# EAGLE design Adafruit GPIO Expander Bonnet (EAGLE 9.2.0)
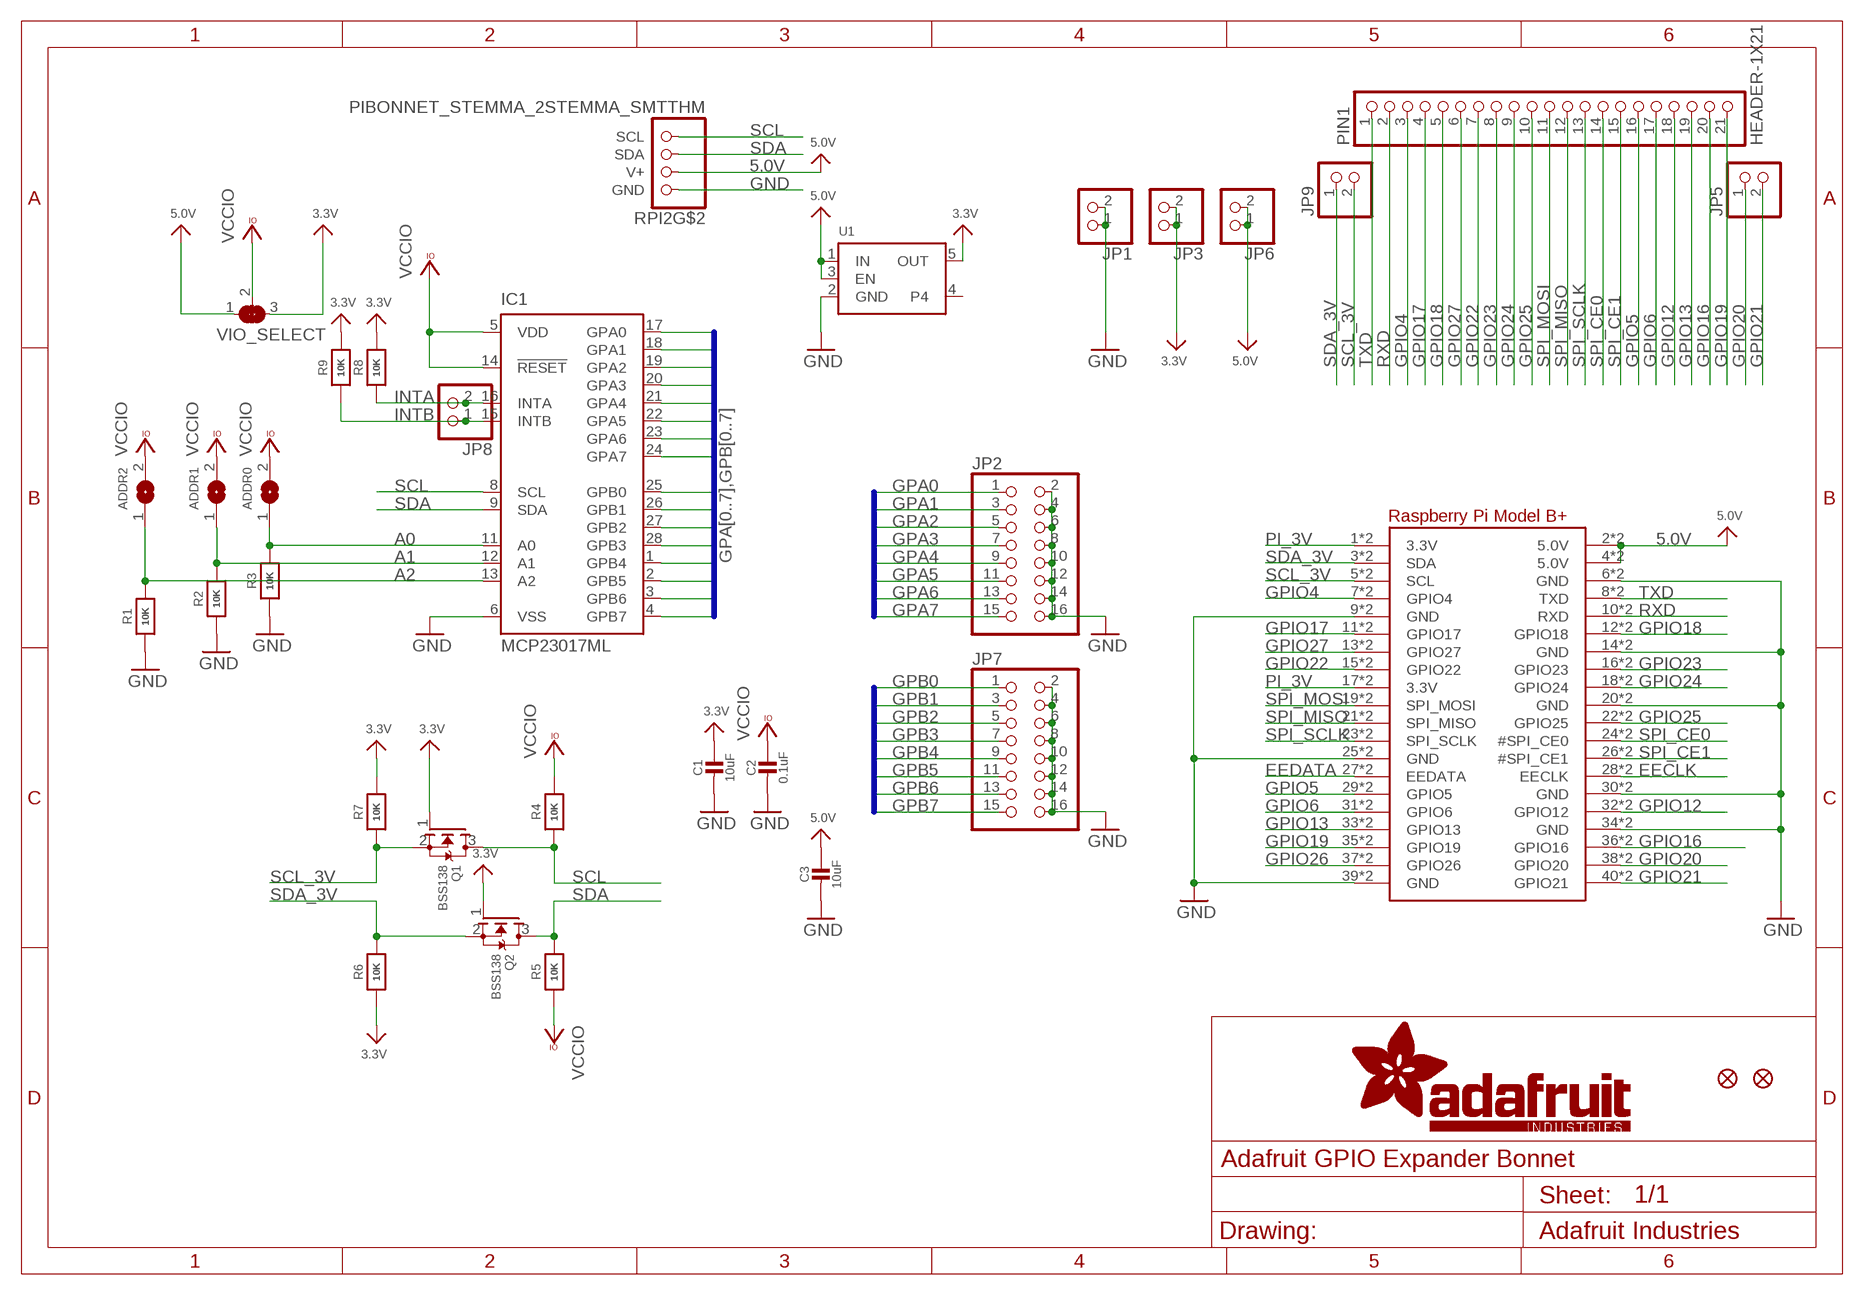
[diagram p0: schematic, sheet 1]

## Parts
ADDR0  SOLDERJUMPER  [SOLDERJUMPER_ARROW_NOPASTE]
ADDR1  SOLDERJUMPER  [SOLDERJUMPER_ARROW_NOPASTE]
ADDR2  SOLDERJUMPER  [SOLDERJUMPER_ARROW_NOPASTE]
C1  10uF  CAP_CERAMIC0805-NOOUTLINE  [0805-NO]
C2  0.1uF  CAP_CERAMIC0603_NO  [0603-NO]
C3  10uF  CAP_CERAMIC0805-NOOUTLINE  [0805-NO]
FID1  FIDUCIAL_1MM  [FIDUCIAL_1MM]
FID2  FIDUCIAL_1MM  [FIDUCIAL_1MM]
IC1  MCP23017ML  [QFN28-ML_6X6MM]
JP1  HEADER-1X2ROUND  [1X02_ROUND]
JP2  HEADER-2X8_SHROUDED  [2X08_SHROUDED]
JP3  HEADER-1X2ROUND  [1X02_ROUND]
JP5  HEADER-1X2ROUND  [1X02_ROUND]
JP6  HEADER-1X2ROUND  [1X02_ROUND]
JP7  HEADER-2X8_SHROUDED  [2X08_SHROUDED]
JP8  HEADER-1X2ROUND  [1X02_ROUND]
JP9  HEADER-1X2ROUND  [1X02_ROUND]
PIN1  HEADER-1X21  [1X21_ROUND_70MIL]
Q1  BSS138  MOSFET-NWIDE  [SOT23-WIDE]
Q2  BSS138  MOSFET-NWIDE  [SOT23-WIDE]
R1  10K  RESISTOR_0603_NOOUT  [0603-NO]
R2  10K  RESISTOR_0603_NOOUT  [0603-NO]
R3  10K  RESISTOR_0603_NOOUT  [0603-NO]
R4  10K  RESISTOR_0603_NOOUT  [0603-NO]
R5  10K  RESISTOR_0603_NOOUT  [0603-NO]
R6  10K  RESISTOR_0603_NOOUT  [0603-NO]
R7  10K  RESISTOR_0603_NOOUT  [0603-NO]
R8  10K  RESISTOR_0603_NOOUT  [0603-NO]
R9  10K  RESISTOR_0603_NOOUT  [0603-NO]
RPI2  PIBONNET_STEMMA_2STEMMA_SMTTHM  [PI_BONNET_2STEMMA_SMT]
U1  VREG_SOT23-5  [SOT23-5]
VIO_SELECT  SOLDERJUMPER_2WAY  [SOLDERJUMPER_2WAY_OPEN_NOPASTE]

## Nets
3.3V: C1.1 JP3.1 JP3.2 Q1.1(G) Q2.1(G) R6.1 R7.2 R8.2 R9.2 U1.5(OUT) VIO_SELECT.3
5.0V: C3.1 JP6.1 JP6.2 RPI2.2(5.0V) RPI2.4(5.0V) RPI2.S2(5.0V) RPI2.S4(5.0V) RPI2.V+ RPI2.V+1(V+) U1.1(IN) U1.3(EN) VIO_SELECT.1
A0: ADDR0.1 IC1.11(A0) R3.2
A1: ADDR1.1 IC1.12(A1) R2.2
A2: ADDR2.1 IC1.13(A2) R1.2
EECLK: RPI2.28(EECLK) RPI2.S28(EECLK)
EEDATA: RPI2.27(EEDATA) RPI2.S27(EEDATA)
GND: C1.2 C2.2 C3.2 IC1.6(VSS) JP1.1 JP1.2 JP2.2 JP2.4 JP2.6 JP2.8 JP2.10 JP2.12 JP2.14 JP2.16 JP7.2 JP7.4 JP7.6 JP7.8 JP7.10 JP7.12 JP7.14 JP7.16 R1.1 R2.1 R3.1 RPI2.6(GND) RPI2.9(GND) RPI2.14(GND) RPI2.20(GND) RPI2.25(GND) RPI2.30(GND) RPI2.34(GND) RPI2.39(GND) RPI2.GND RPI2.GND1(GND) RPI2.S6(GND) RPI2.S9(GND) RPI2.S14(GND) RPI2.S20(GND) RPI2.S25(GND) RPI2.S30(GND) RPI2.S34(GND) RPI2.S39(GND) U1.2(GND)
GPA0: IC1.17(GPA0) JP2.1
GPA1: IC1.18(GPA1) JP2.3
GPA2: IC1.19(GPA2) JP2.5
GPA3: IC1.20(GPA3) JP2.7
GPA4: IC1.21(GPA4) JP2.9
GPA5: IC1.22(GPA5) JP2.11
GPA6: IC1.23(GPA6) JP2.13
GPA7: IC1.24(GPA7) JP2.15
GPB0: IC1.25(GPB0) JP7.1
GPB1: IC1.26(GPB1) JP7.3
GPB2: IC1.27(GPB2) JP7.5
GPB3: IC1.28(GPB3) JP7.7
GPB4: IC1.1(GPB4) JP7.9
GPB5: IC1.2(GPB5) JP7.11
GPB6: IC1.3(GPB6) JP7.13
GPB7: IC1.4(GPB7) JP7.15
GPIO4: PIN1.3 RPI2.7(GPIO4) RPI2.S7(GPIO4)
GPIO5: PIN1.16 RPI2.29(GPIO5) RPI2.S29(GPIO5)
GPIO6: PIN1.17 RPI2.31(GPIO6) RPI2.S31(GPIO6)
GPIO12: PIN1.18 RPI2.32(GPIO12) RPI2.S32(GPIO12)
GPIO13: PIN1.19 RPI2.33(GPIO13) RPI2.S33(GPIO13)
GPIO16: PIN1.20 RPI2.36(GPIO16) RPI2.S36(GPIO16)
GPIO17: PIN1.4 RPI2.11(GPIO17) RPI2.S11(GPIO17)
GPIO18: PIN1.5 RPI2.12(GPIO18) RPI2.S12(GPIO18)
GPIO19: PIN1.21 RPI2.35(GPIO19) RPI2.S35(GPIO19)
GPIO20: JP5.1 RPI2.38(GPIO20) RPI2.S38(GPIO20)
GPIO21: JP5.2 RPI2.40(GPIO21) RPI2.S40(GPIO21)
GPIO22: PIN1.7 RPI2.15(GPIO22) RPI2.S15(GPIO22)
GPIO23: PIN1.8 RPI2.16(GPIO23) RPI2.S16(GPIO23)
GPIO24: PIN1.9 RPI2.18(GPIO24) RPI2.S18(GPIO24)
GPIO25: PIN1.10 RPI2.22(GPIO25) RPI2.S22(GPIO25)
GPIO26: RPI2.37(GPIO26) RPI2.S37(GPIO26)
GPIO27: PIN1.6 RPI2.13(GPIO27) RPI2.S13(GPIO27)
INTA: IC1.16(INTA) JP8.2 R8.1
INTB: IC1.15(INTB) JP8.1 R9.1
PI_3V: RPI2.1(3.3V) RPI2.17(3.3V) RPI2.S1(3.3V) RPI2.S17(3.3V)
RXD: PIN1.2 RPI2.10(RXD) RPI2.S10(RXD)
SCL: IC1.8(SCL) Q1.3(D) R4.1 RPI2.SCL RPI2.SCL1(SCL)
SCL_3V: JP9.2 Q1.2(S) R7.1 RPI2.5(SCL) RPI2.S5(SCL)
SDA: IC1.9(SDA) Q2.3(D) R5.2 RPI2.SDA RPI2.SDA1(SDA)
SDA_3V: JP9.1 Q2.2(S) R6.2 RPI2.3(SDA) RPI2.S3(SDA)
SPI_CE0: PIN1.14 RPI2.24(#SPI_CE0) RPI2.S24(#SPI_CE0)
SPI_CE1: PIN1.15 RPI2.26(#SPI_CE1) RPI2.S26(#SPI_CE1)
SPI_MISO: PIN1.12 RPI2.21(SPI_MISO) RPI2.S21(SPI_MISO)
SPI_MOSI: PIN1.11 RPI2.19(SPI_MOSI) RPI2.S19(SPI_MOSI)
SPI_SCLK: PIN1.13 RPI2.23(SPI_SCLK) RPI2.S23(SPI_SCLK)
TXD: PIN1.1 RPI2.8(TXD) RPI2.S8(TXD)
VCCIO: ADDR0.2 ADDR1.2 ADDR2.2 C2.1 IC1.5(VDD) IC1.14(!RESET) R4.2 R5.1 VIO_SELECT.2
Unconnected: U1.4

## Buses
GPA[0..7],GPB[0..7]

## Library data of the parts
ADDR0 ADDR1 ADDR2 = microbuilder:SOLDERJUMPER: SMD Solder JUMPER Solder the two pads together to create a connection, or remove the solder to break it. REFLOW - Use this footprint for solder paste and reflow ovens. WAVE - Use this footprint for hand-soldering (larger pads). CLOSED - Has a trace between the two pads to ensure it is closed by default. The trace needs to be cut to disable the jumper, and can be closed again by creating a solder bridge between the two pads.; BOM: EXCLUDE
C1-C3 = microbuilder:CAP_CERAMIC: Ceramic Capacitors For new designs, use the packages preceded by an '_' character since they are more reliable: The following footprints should be used on most boards: _0402 - Standard footprint for regular board layouts _0603 - Standard footprint for regular board layouts _0805 - Standard footprint for regular board layouts _1206 - Standard footprint for regular board layouts For extremely tight-pitch boards where space is at a premium, the following 'micro-pitch' footprints can be used (smaller pads, no silkscreen outline, etc.): _0402MP - Micro-pitch footprint for very dense/compact boards _0603MP - Micro-pitch footprint for very dense/compact boards _0805MP - Micro-pitch footprint for very dense/compact boards _1206MP - Micro-pitch footprint for very dense/compact boards
FID1 FID2 = microbuilder:FIDUCIAL: Fiducial Alignment Points Various fiducial points for machine vision alignment.; BOM: EXCLUDE
IC1 = microbuilder:MCP23017: http://ww1.microchip.com/downloads/en/DeviceDoc/21952a.pdf Source: http://ww1.microchip.com/downloads/en/DeviceDoc/21952a.pdf; MF: MICROCHIP; MPN: MCP23017-E/ML; OC_FARNELL: unknown; OC_NEWARK: 31K2957
JP1 JP3 JP5 JP6 JP8 JP9 = microbuilder:HEADER-1X2: PIN HEADER
JP2 JP7 = microbuilder:HEADER-2X8
PIN1 = microbuilder:HEADER-1X21
Q1 Q2 = microbuilder:MOSFET-N: N-Channel Mosfet LEGEND VDS: Voltage Drain-Source ID: Drain Current RDS(ON): Drain-Source On-State Resistance VGS(TH): Gate-Source Threshold Voltage CISS: Drain-Source Input Capacitance SOT-23 Name VDS ID RDS(ON) VGS(TH) CISS Order Number 2N7002E 60V 260mA 2.5 Ohm 2.5V @ 250uA 26.7pF @ 25V 2N7002ET1GOSTR-ND BSH103 30V 850mA 400 mOhm 400mV @ 1mA 83pF @ 24V BSH103,235-ND BSS138 60V 320mA 1.6 Ohm 1.5V @ 250uA 50pF @ 10V Mouser: 771-BSS138PW115 DMN2075U-7 20V 4.2A 38 mOhm 1V @ 250 uA 594.3pF @ 10V DMN2075U-7DICT-ND * BSS138 good choice for I2C level-shifting POWERPAK 1212-8 Name VDS ID RDS(ON) VGS(TH) CISS Order Number Si7308DN 60V 6A 58 mOhm 3V @ 250uA 665pF @ 15V SI7308DN-T1-E3CT-ND
R1-R9 = microbuilder:RESISTOR: Resistors For new designs, use the packages preceded by an '_' character since they are more reliable: The following footprints should be used on most boards: _0402 - Standard footprint for regular board layouts _0603 - Standard footprint for regular board layouts _0805 - Standard footprint for regular board layouts _1206 - Standard footprint for regular board layouts For extremely tight-pitch boards where space is at a premium, the following 'micro-pitch' footprints can be used (smaller pads, no silkscreen outline, etc.): _0402MP - Micro-pitch footprint for very dense/compact boards _0603MP - Micro-pitch footprint for very dense/compact boards _0805MP - Micro-pitch footprint for very dense/compact boards _1206MP - Micro-pitch footprint for very dense/compact boards
RPI2 = microbuilder:PIBONNET_STEMMA
U1 = microbuilder:VREG_SOT23-5: SOT23-5 Fixed Voltage Regulators Part Current Out V Out V In V Dropout θJA (°C/W) TJ (°C) Digikey Part No. ADP121 150mA 3.3V 3.4-5.5V 0.09V @ 150mA -- -- ADP121-AUJZ33R7CT-ND ADP121 150mA 3.0V 3.1-5.5V 0.09V @ 150mA -- -- ADP121-AUJZ30R7CT-ND ADP122 300mA 3.3V 3.4-5.5V 0.085V @ 300mA -- -- ADP122AUJZ-3.3-R7CT-ND ADP1712 300mA 3.3V 3.5-5.5V 0.17V @ 300mA -- -- ADP1712AUJZ-3.3-R7TR-ND AP7311 (Low Cost) 150mA 3.3V 3.5-6V 0.15V @ 150mA -- -- AP7311-33WG-7DICT-ND LD39015M18R 150mA 1.8V 1.9V-5.5V 0.08V @ 100mA -- -- 497-6977-1-ND LP2985A-33DBVR 150mA 3.3V 3.3-16V 0.28V @ 150mA 206 150 296-18479-1-ND MCP1824T-3302E/OT 300mA 3.3V 3.5V-6V 0.2V @ 300mA -- -- MCP1824T-3302E/OTCT-ND MIC5205-2.5YM5 TR 150mA 2.5V 2.7-16V 0.165V @ 150mA -- -- 576-1257-2-ND MIC5205-3.0YM5 TR 150mA 3.0V 3.2V-16V 0.165V @ 150mA -- -- 576-1258-2-ND MIC5205-3.3YM5 TR 150mA 3.3V 3.5V-16V 0.165V @ 150mA -- -- 576-1259-2-ND TPS780330220 150mA 3.3V+2.2V 3.6-5.5V 250mV Max -- -- 296-23332-1-ND TDA3663/N1,135 100mA 3.3V 3.5-45V 0.18V @ 50mA -- -- 568-5343-1-ND Max operating temp can be calculated using θJA, TJ (max junction temperature), and power in watts. Set the "Maximum Ambient Temperature" until it reaches TJ ("Max Junction Temperature"), which is the absolute limit for safe use of the regulator: Heat Sink Temperature Calculator <http://www.daycounter.com/Calculators/Heat-Sink-Temperature-Calculator.phtml> For example, With 12V source into a 3.3V LP2985 and a 30mA load, we are dissipating (12V-3.3V) * 0.03A = 0.261W. With a θJA of 206 °C/W, a TJ of 150°C, and 261mW we can safely use the chip without a heat sink up to 75°C (=147.1°C Junction Temperature).
VIO_SELECT = microbuilder:SOLDERJUMPER_2WAY: 2-Way Solder Jumper

## Board
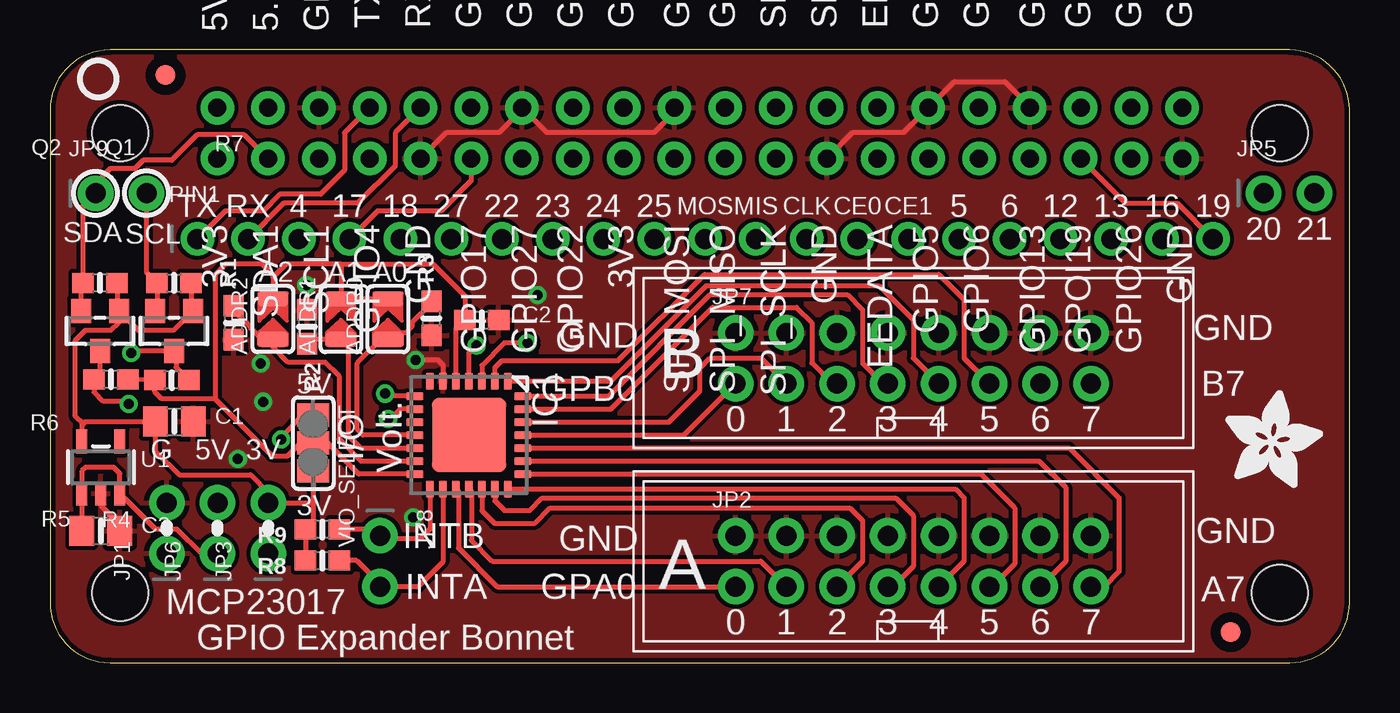
[diagram p1: board, top side]
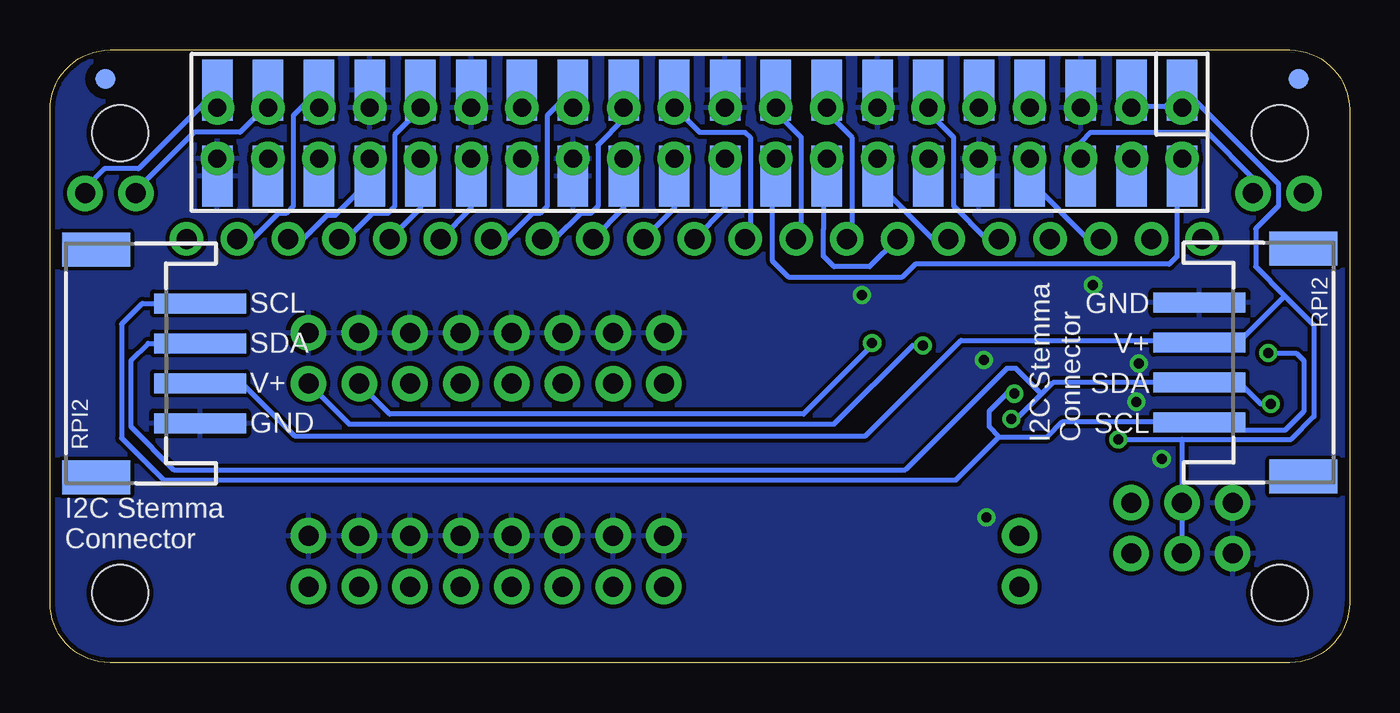
[diagram p2: board, bottom side, seen from below]

Size 65 x 30.66 mm. Coordinates in mm from the lower left corner, seen from the top.
Copper layers (1*16): Top 0.035mm / dielectric 1.5mm / Bottom 0.035mm
Design rules "adafruit *": minimum track width 8mil, minimum drill 15.5mil, track to track 8mil, track to pad 8mil, pad to pad 8mil, via to via 8mil, smd to smd 8mil, copper to edge 10mil, drill to drill 8mil, minimum pad ring 10mil, minimum via ring 8mil, stop-mask expansion 2mil, vias tented up to drill 20mil, thermal gap 10mil

### Footprints (pad centres in the part's own frame; a part is rotated, then mirrored left to right if it is on the bottom)
SOLDERJUMPER_ARROW_NOPASTE = smd 0.762 x 1.524: 1 -1.016,0; 2 1.016,0
0805-NO = smd 1.24 x 1.5: 1 -0.95,0; 2 0.95,0
0603-NO = smd 1.075 x 1: 1 -0.85,0; 2 0.85,0
FIDUCIAL_1MM = smd 1 x 1: 1 0,0
QFN28-ML_6X6MM = smd 0.85 x 0.4: 1 -2.7,1.95; 2 -2.7,1.3; 3 -2.7,0.65; 4 -2.7,0; 5 -2.7,-0.65; 6 -2.7,-1.3; 7 -2.7,-1.95; 15 2.7,-1.95; 16 2.7,-1.3; 17 2.7,-0.65; 18 2.7,0; 19 2.7,0.65; 20 2.7,1.3; 21 2.7,1.95 | smd 0.4 x 0.85: 8 -1.95,-2.7; 9 -1.3,-2.7; 10 -0.65,-2.7; 11 0,-2.7; 12 0.65,-2.7; 13 1.3,-2.7; 14 1.95,-2.7; 22 1.95,2.7; 23 1.3,2.7; 24 0.65,2.7; 25 0,2.7; 26 -0.65,2.7; 27 -1.3,2.7; 28 -1.95,2.7 | smd 3.7 x 3.7: EXP 0,0
1X02_ROUND = drill 1 pad 1.778: 1 -1.27,0; 2 1.27,0
2X08_SHROUDED = drill 1 pad 1.778: 1 -8.89,-1.27; 2 -8.89,1.27; 3 -6.35,-1.27; 4 -6.35,1.27; 5 -3.81,-1.27; 6 -3.81,1.27; 7 -1.27,-1.27; 8 -1.27,1.27; 9 1.27,-1.27; 10 1.27,1.27; 11 3.81,-1.27; 12 3.81,1.27; 13 6.35,-1.27; 14 6.35,1.27; 15 8.89,-1.27; 16 8.89,1.27
1X21_ROUND_70MIL = drill 1 pad 1.676: 1 -25.4,0; 2 -22.86,0; 3 -20.32,0; 4 -17.78,0; 5 -15.24,0; 6 -12.7,0; 7 -10.16,0; 8 -7.62,0; 9 -5.08,0; 10 -2.54,0; 11 0,0; 12 2.54,0; 13 5.08,0; 14 7.62,0; 15 10.16,0; 16 12.7,0; 17 15.24,0; 18 17.78,0; 19 20.32,0; 20 22.86,0; 21 25.4,0
SOT23-WIDE = smd 1 x 1.2: 1 -0.95,-1; 2 0.95,-1; 3 0,1
PI_BONNET_2STEMMA_SMT = drill 0.9 pad 1.676: 1 8.37,25.23; 2 8.37,27.77; 3 10.91,25.23; 4 10.91,27.77; 5 13.45,25.23; 6 13.45,27.77; 7 15.99,25.23; 8 15.99,27.77; 9 18.53,25.23; 10 18.53,27.77; 11 21.07,25.23; 12 21.07,27.77; 13 23.61,25.23; 14 23.61,27.77; 15 26.15,25.23; 16 26.15,27.77; 17 28.69,25.23; 18 28.69,27.77; 19 31.23,25.23; 20 31.23,27.77; 21 33.77,25.23; 22 33.77,27.77; 23 36.31,25.23; 24 36.31,27.77; 25 38.85,25.23; 26 38.85,27.77; 27 41.39,25.23; 28 41.39,27.77; 29 43.93,25.23; 30 43.93,27.77; 31 46.47,25.23; 32 46.47,27.77; 33 49.01,25.23; 34 49.01,27.77; 35 51.55,25.23; 36 51.55,27.77; 37 54.09,25.23; 38 54.09,27.77; 39 56.63,25.23; 40 56.63,27.77 | smd 1 x 1 bottom: FID1 2.54,29.21; FID2 62.23,29.21 | smd 4.6 x 1 bottom: GND 7.51,18.02; GND1 57.49,11.98; SCL 7.51,12.02; SCL1 57.49,17.98; SDA 7.51,14.02; SDA1 57.49,15.98; V+ 7.51,16.02; V+1 57.49,13.98 | smd 3.4 x 1.7 bottom: NC1 2.31,20.72; NC2 2.31,9.32; NC3 62.69,9.28; NC4 62.69,20.68 | smd 1.524 x 3.048 bottom: S1 8.37,24.339; S2 8.37,28.657; S3 10.91,24.339; S4 10.91,28.657; S5 13.45,24.339; S6 13.45,28.657; S7 15.99,24.339; S8 15.99,28.657; S9 18.53,24.339; S10 18.53,28.657; S11 21.07,24.339; S12 21.07,28.657; S13 23.61,24.339; S14 23.61,28.657; S15 26.15,24.339; S16 26.15,28.657; S17 28.69,24.339; S18 28.69,28.657; S19 31.23,24.339; S20 31.23,28.657; S21 33.77,24.339; S22 33.77,28.657; S23 36.31,24.339; S24 36.31,28.657; S25 38.85,24.339; S26 38.85,28.657; S27 41.39,24.339; S28 41.39,28.657; S29 43.93,24.339; S30 43.93,28.657; S31 46.47,24.339; S32 46.47,28.657; S33 49.01,24.339; S34 49.01,28.657; S35 51.55,24.339; S36 51.55,28.657; S37 54.09,24.339; S38 54.09,28.657; S39 56.63,24.339; S40 56.63,28.657 | hole 2.8: 3.5,26.5; 61.5,26.5; 61.5,3.5; 3.5,3.5
SOT23-5 = smd 0.55 x 1.2: 1 -0.95,-1.3; 2 0,-1.3; 3 0.95,-1.3; 4 0.95,1.3; 5 -0.95,1.3
SOLDERJUMPER_2WAY_OPEN_NOPASTE = smd 1.168 x 1.6: 1 -1.397,0; 2 0,0; 3 1.397,0

### Placement (x,y rotation side)
ADDR0  16.91,17.19 90 top
ADDR1  14.55,17.19 90 top
ADDR2  11.15,17.19 90 top
C1  6.22,12.06 0 top
C2  21.59,17.14 0 top
C3  2.54,6.6 0 top
FID1  5.78,29.4 0 top
FID2  59.05,1.52 0 top
IC1  20.96,11.39 270 top
JP1  5.84,6.73 90 top
JP2  43.18,5.08 0 top
JP3  10.92,6.73 90 top
JP5  61.98,23.5 0 top
JP6  8.38,6.73 90 top
JP7  43.18,15.24 0 top
JP8  16.51,5.08 270 top
JP9  3.56,23.5 0 top
PIN1  32.77,21.21 0 top
Q1  6.2,16.6 180 top
Q2  2.5,16.6 180 top
R1  9.19,17 90 top
R2  12.85,16.81 270 top
R3  19.08,17.23 90 top
R4  6.09,14.15 180 top
R5  3.06,14.18 180 top
R6  2.5,19 180 top
R7  6.2,19 0 top
R8  13.63,5.11 180 top
R9  13.63,6.67 180 top
RPI2  0,0 0 top
U1  2.54,9.78 0 top
U$12  [ADAFRUIT_5MM]  58.8,8.76 0 top
U$13  [PCBFEAT-REV-040]  2.41,29.21 0 top
VIO_SELECT  13.17,10.99 270 top

### Tracks (layer width: path | path; a pad name or v marks a point on that pad's centre or on a via)
3.3V
  Top 0.254: R6.1 3.35,17.7 3.41,17.64 | 3.41,17.64 Q2.1 4.41,16.64 6.19,16.64 Q1.1 7.05,17.7 R7.2 | JP3.2 JP3.1 | VIO_SELECT.3 13.17,8.13 | 13.17,8.13 13.17,7.05 R9.2 R8.2 | 1.65,11.94 1.27,12.32 1.27,16.13 1.78,16.64 3.05,16.64 3.41,17 3.41,17.64 | U1.5 1.59,11.88 1.65,11.94 | 1.65,11.94 1.78,12.06 C1.1 | C1.1 5.27,12 | JP3.2 13.04,8 13.17,8.13 | C1.1 5.27,10.6 6.48,9.4 10.03,9.4 10.92,8.51 JP3.2
5.0V  (via drill 0.5)
  Top 0.254: VIO_SELECT.1 12.65,12.39 11.56,11.3 v11.56,11.18 | C3.1 U1.1 1.59,9.59 1.78,9.78 3.17,9.78 3.49,9.46 U1.3 5.29,6.68 6.35,6.68 7.57,5.46 JP6.1
  Bottom 0.254: 8.38,11.18 JP6.2 JP6.1 | v11.56,11.18 8.38,11.18 | 8.38,11.18 2.92,11.18 1.78,12.32 1.78,16.89 3.24,18.35 | RPI2.S4 10.91,27.81 | 10.91,27.81 RPI2.4 | RPI2.4 | RPI2.S2 8.24,28.66 3.56,23.97 3.56,22.86 4.7,21.72 4.7,19.81 3.24,18.35 | RPI2.S2 RPI2.2 | RPI2.2 | RPI2.S2 9.21,27.81 10.91,27.81 | RPI2.V+1 55.38,13.98 52.76,11.35 24.21,11.35 19.43,16.13 7.62,16.13 | 7.62,16.13 RPI2.V+ | 7.62,16.13 5.46,16.13 3.24,18.35
A0
  Top 0.254: IC1.11 15.66,11.39 15.37,11.68 15.37,14.99 16.41,16.03 16.41,16.28 16.52,16.18 ADDR0.1 17.24,16.51 17.78,16.51 18.12,16.86 18.12,17.02 19.08,17.98 R3.2
A1
  Top 0.254: IC1.12 15.54,10.74 14.91,11.38 14.91,15.82 ADDR1.1 13.02,16.18 12.85,16.01 R2.2
A2
  Top 0.254: IC1.13 15.55,10.1 14.45,11.19 14.45,14.35 13.77,15.03 11.91,15.03 11.15,15.79 ADDR2.1 10.62,16.18 10.02,16.78 10.02,16.82 9.83,17.02 9.78,17.02 9.19,17.61 R1.2
EECLK
  Bottom 0.254: RPI2.S28 RPI2.28 | RPI2.28
EEDATA
  Bottom 0.254: RPI2.S27 RPI2.27 | RPI2.27
GND  (via drill 0.5)
  Top 0.254: R2.1 12.85,18.88 v12.83,18.9 | IC1.6 19.67,14.1 19.67,14.89 19.4,15.15 v18.29,15.15 | RPI2.9 19.84,26.54 22.48,26.54 23.61,27.67 RPI2.14 24.84,26.54 30.23,26.54 31.23,27.55 RPI2.20 | RPI2.25 40.16,26.54 42.7,26.54 RPI2.30 45.24,29.08 47.75,29.08 49.01,27.82 RPI2.34 | U1.2 2.54,7.87 3.49,6.92 C3.2
  Bottom 0.254: RPI2.S9 | RPI2.S9 RPI2.9
  other vias: 10.54,14.96 24.38,18.39 10.67,13.06 18.16,7.28 9.4,10.2
  pour Bottom: 0,30.99 64.77,30.99 64.77,0 0,0
  pour Top: 0,30.99 64.77,30.99 64.77,0 0,0
GPA0
  Top 0.254: IC1.17 20.43,8.57 20.43,5.74 22.36,3.81 JP2.1
GPA1
  Top 0.254: IC1.18 21.08,8.57 21.08,6.12 22.12,5.08 35.56,5.08 JP2.3
GPA2
  Top 0.254: IC1.19 21.61,7.6 22.23,6.99 24.26,6.99 25.02,7.75 40.01,7.75 40.64,7.11 40.64,5.08 JP2.5
GPA3
  Top 0.254: IC1.20 22.26,8.09 22.73,7.62 24,7.62 24.62,8.24 42.31,8.24 43.18,7.37 43.18,4.83 42.16,3.81 JP2.7
GPA4
  Top 0.254: IC1.21 45.28,8.7 45.72,8.26 45.72,5.08 JP2.9
GPA5
  Top 0.254: IC1.22 46.56,9.45 48.26,7.75 48.26,4.95 47.12,3.81 JP2.11
GPA6
  Top 0.254: IC1.23 49.47,10.1 50.8,8.76 50.8,5.08 JP2.13
GPA7
  Top 0.254: IC1.24 50.98,10.74 53.47,8.26 53.47,4.57 52.7,3.81 JP2.15
GPB0
  Top 0.254: IC1.25 31.71,11.39 JP7.1
GPB1
  Top 0.254: IC1.26 30.97,12.04 32.51,13.59 32.51,14.73 33.02,15.24 35.56,15.24 JP7.3
GPB2
  Top 0.254: IC1.27 28.06,12.7 33.15,17.78 37.34,17.78 38.1,17.02 38.1,14.99 39.12,13.97 JP7.5
GPB3
  Top 0.254: IC1.28 27.95,13.35 33.02,18.41 39.88,18.41 40.64,17.65 40.64,14.99 41.66,13.97 JP7.7
GPB4
  Top 0.254: IC1.1 28.05,14.1 32.83,18.87 41.45,18.87 43.18,17.14 43.18,15.24 JP7.9
GPB5
  Top 0.254: IC1.2 22.26,14.77 22.61,15.11 28.43,15.11 32.74,19.43 44.45,19.43 45.72,18.16 45.72,15.24 JP7.11
GPB6  (via drill 0.5)
  Top 0.254: IC1.3 21.6,14.1 21.6,14.88 22.72,16 v23.88,16
  Bottom 0.254: v23.88,16 23.88,15.88 27.3,12.45 48.01,12.45 JP7.13
GPB7  (via drill 0.5)
  Top 0.254: IC1.4 20.96,15.5 v21.34,15.88
  Bottom 0.254: v21.34,15.88 21.84,15.88 25.78,11.94 50.04,11.94 JP7.15
GPIO4
  Bottom 0.254: RPI2.S7 | RPI2.S7 RPI2.7 | RPI2.S7 15.99,24.12 13.08,21.21 PIN1.3
GPIO5
  Bottom 0.254: RPI2.29 RPI2.S29 43.93,22.75 PIN1.16 | RPI2.29
GPIO6
  Bottom 0.254: RPI2.31 RPI2.S31 46.47,22.75 PIN1.17 | RPI2.31
GPIO12
  Bottom 0.254: 46.47,29.09 RPI2.S32 46.47,27.7 47.75,26.42 47.75,22.84 48.11,22.48 48.89,22.48 50.16,21.21 PIN1.18 | 46.47,29.09 | 46.47,29.09 RPI2.32
GPIO13
  Bottom 0.254: RPI2.33 RPI2.S33 49.01,24.13 50.76,22.38 51.16,22.38 52.33,21.21 PIN1.19 | RPI2.33
GPIO16
  Bottom 0.254: RPI2.S36 52.83,27.38 52.83,22.84 53.19,22.48 53.59,22.48 54.99,21.08 55.5,21.08 PIN1.20 | RPI2.S36 | RPI2.S36 RPI2.36
GPIO17
  Top 0.254: RPI2.11 21.07,24.12 19.56,22.61 16.38,22.61 PIN1.4
  Bottom 0.254: 21.07,25.02 RPI2.11 | RPI2.S11 21.07,25.02 | 21.07,25.02
GPIO18
  Bottom 0.254: RPI2.S12 | RPI2.S12 RPI2.12 | RPI2.S12 21.07,27.55 19.81,26.29 19.81,22.87 18.15,21.21 PIN1.5
GPIO19
  Top 0.254: RPI2.35 53.79,22.99 56.39,22.99 PIN1.21
  Bottom 0.254: RPI2.S35 RPI2.35
GPIO20
  Bottom 0.254: JP5.1 60.71,23.62 57.78,26.54 55.5,26.54 54.09,27.95 RPI2.S38 RPI2.38 | RPI2.38
GPIO21
  Bottom 0.254: JP5.2 63.25,23.75 62.26,24.74 62.24,24.72 60.57,24.72 RPI2.S40 RPI2.40 | RPI2.40
GPIO22
  Bottom 0.254: RPI2.S15 | RPI2.S15 26.15,24.4 | 26.15,24.4 RPI2.15 | PIN1.7 24,19.81 25.78,19.81 26.31,20.34 26.31,21.69 26.29,21.72 26.29,23.5 26.67,23.88 26.15,24.4
GPIO23
  Bottom 0.254: RPI2.16 26.16,27.77 26.16,28.66 RPI2.S16 26.15,27.55 24.89,26.29 24.89,21.46 PIN1.8
GPIO24
  Bottom 0.254: RPI2.S18 | RPI2.S18 RPI2.18 | RPI2.S18 28.69,27.55 27.43,26.29 27.43,21.46 PIN1.9
GPIO25
  Bottom 0.254: RPI2.S22 | RPI2.S22 RPI2.22 | RPI2.S22 33.77,27.8 32.51,26.54 30.23,26.54 29.97,26.29 29.97,21.46 PIN1.10
GPIO26
  Bottom 0.254: RPI2.S37 RPI2.37
GPIO27
  Bottom 0.254: RPI2.13 | RPI2.13 RPI2.S13 23.61,23.99 20.83,21.21 PIN1.6
INTA
  Top 0.254: IC1.16 19.66,5.05 18.41,3.81 16.64,3.81 | 16.64,3.81 JP8.2 | R8.1 15.33,5.11 16.64,3.81
INTB
  Top 0.254: IC1.15 19.01,6.69 18.54,6.22 16.64,6.22 JP8.1 16.19,6.67 R9.1
N$1
  Top 0.254: 13.21,11.94 13.21,11.43
PI_3V
  Bottom 0.254: RPI2.S1 RPI2.1 | RPI2.1 | RPI2.S1 RPI2.1 | RPI2.1 | RPI2.S1 8.64,24.07 8.64,20.32 9.02,19.94 21.72,19.94 22.35,19.3 28.07,19.3 28.85,20.09 28.85,24.18 | 28.85,24.18 28.85,24.35 28.69,24.51 | RPI2.17 RPI2.S17 28.85,24.18
RXD
  Top 0.254: RPI2.10 17.27,26.51 17.27,24.86 15.4,22.99 11.68,22.99 PIN1.2
  Bottom 0.254: RPI2.S10 18.92,28.66 18.92,27.77 RPI2.10
SCL  (via drill 0.5)
  Top 0.254: IC1.8 16.88,13.35 v16.76,13.46 | R4.1 6.3,14.79 6.3,15.5 Q1.3 4.17,15.6 v4.06,15.49
  Bottom 0.254: v16.76,13.46 17.14,13.46 18.03,12.57 18.03,11.81 17.53,11.3 | 17.53,11.3 15.11,11.3 14.35,12.06 7.55,12.06 RPI2.SCL 7.13,11.64 3.22,11.64 2.29,12.57 2.29,15.11 2.67,15.49 v4.06,15.49 | 17.53,11.3 19.68,9.14 59.32,9.14 61.42,11.24 61.42,16.94 60.38,17.98 RPI2.SCL1
SCL_3V
  Top 0.254: Q1.2 5.35,17.7 R7.1 4.83,19.52 JP9.2
  Bottom 0.254: RPI2.S5 | RPI2.S5 RPI2.5 13.45,26.05 12.95,26.54 7.11,26.54 4.83,24.26 JP9.2
SDA  (via drill 0.5)
  Top 0.254: IC1.9 17.54,12.7 17.04,12.19 v16.91,12.19 | v3.94,12.95 3.81,13.08 2.67,13.08 2.21,13.54 R5.2 2.5,14.48 Q2.3
  Bottom 0.254: v16.91,12.19 16.66,12.19 15.4,13.45 | v3.94,12.95 4.45,12.95 5.51,14.02 RPI2.SDA 14.83,14.02 15.4,13.45 | 15.4,13.45 16.68,14.73 17.14,14.73 22.23,9.65 58.8,9.65 60.96,11.81 60.96,15.11 60.09,15.98 RPI2.SDA1
SDA_3V
  Top 0.254: Q2.2 1.55,18.9 R6.2 1.65,22.86 JP9.1 2.29,24 2.41,24.13 3,24.72 4.24,24.72 4.67,25.15 6.1,25.15 7.37,26.42 9.72,26.42 RPI2.3
  Bottom 0.254: RPI2.S3 RPI2.3 | RPI2.3
SPI_CE0
  Bottom 0.254: RPI2.24 RPI2.S24 36.31,27.19 37.59,25.91 37.59,22.84 37.95,22.48 38.48,22.48 39.75,21.21 PIN1.14 | RPI2.24
SPI_CE1
  Bottom 0.254: RPI2.S26 | RPI2.S26 RPI2.26 | RPI2.S26 40.13,27.38 40.13,22.84 40.49,22.48 40.89,22.48 42.16,21.21 PIN1.15
SPI_MISO
  Bottom 0.254: RPI2.S21 | RPI2.S21 RPI2.21 | RPI2.S21 33.77,22.75 PIN1.12
SPI_MOSI
  Bottom 0.254: RPI2.S19 | RPI2.S19 RPI2.19 | RPI2.S19 31.23,22.75 PIN1.11
SPI_SCLK
  Bottom 0.254: RPI2.S23 | RPI2.S23 RPI2.23 | RPI2.S23 36.31,22.75 PIN1.13
TXD
  Top 0.254: RPI2.8 14.73,26.51 14.73,24.64 13.54,23.44 11.49,23.44 10.66,22.61 8.76,22.61 PIN1.1
  Bottom 0.254: RPI2.S8 RPI2.8 | RPI2.8
VCCIO
  Top 0.254: ADDR2.2 11.15,19.28 11.21,19.34 | 14.55,19.94 11.81,19.94 11.21,19.34 | 14.55,19.94 ADDR1.2 ADDR0.2 | R4.2 | R4.2 R5.1 | IC1.14 15.45,9.45 13.9,10.99 VIO_SELECT.2 12.53,10.99 11.9,10.36 11.1,10.36 8.26,13.21 | 11.21,19.34 10.62,19.94 8.76,19.94 8.26,19.43 8.26,13.21 | 14.55,19.94 19.17,19.94 20.77,18.34 20.77,17.17 C2.1 20.31,16.71 IC1.5 | 8.26,13.21 5.59,13.21 5.24,13.56 R4.2

### Text on the board
tPlace: TX | RX | 4 | 17 | 18 | 27 | 22 | 23 | 24 | 25 | MOS | MIS | CLK | CE0 | CE1 | 5 | 6 | 12 | 13 | 16 | 19 | SDA | 20 | 21 | SCL | A2 | A1 | A0 | GND | GND | B | 5V | GPB0 | B7 | 0 | 1 | 2 | 3 | 4 | 5 | 6 | 7 | G | 5V | 3V | I/O / Volt. | 3V | GND | INTB | GND | A | INTA | GPA0 | A7 | MCP23017 | 0 | 1 | 2 | 3 | 4 | 5 | 6 | 7 | GPIO Expander Bonnet
bPlace: I2C Stemma / Connector | I2C Stemma / Connector